# Altium schematic sheet Sheet1.SchDoc
size A4; SheetNumber: 1; SheetTotal: 1
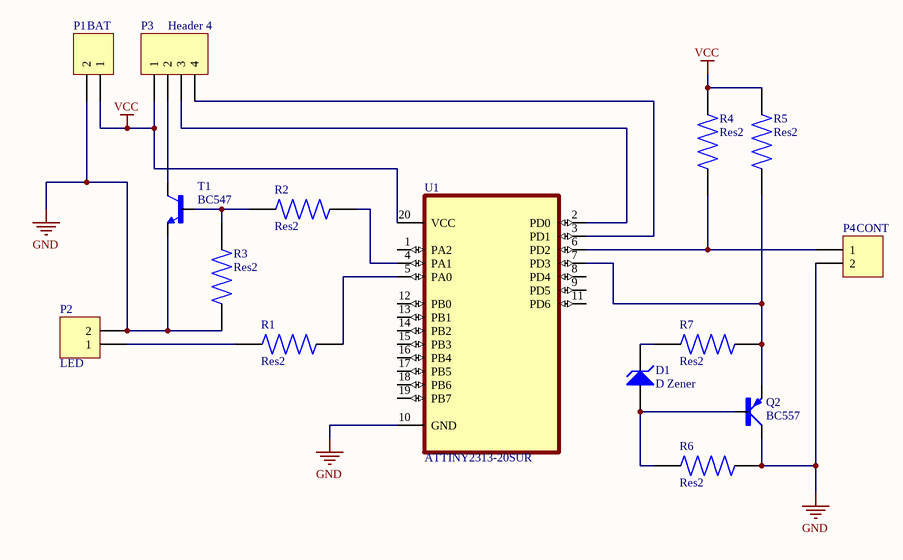
[diagram p0: Sheet1.SchDoc]

## Parts
D1  D Zener  [DIODE-0.7]
P1  BAT  [HDR1X2]
P2  LED  [HDR1X2]
P3  Header 4  [HDR1X4]
P4  CONT  [HDR1X2]
Q2  BC557  [SOT54A]
R1  Res2  [AXIAL-0.4]
R2  Res2  [AXIAL-0.4]
R3  Res2  [AXIAL-0.4]
R4  Res2  [AXIAL-0.4]
R5  Res2  [AXIAL-0.4]
R6  Res2  [AXIAL-0.4]
R7  Res2  [AXIAL-0.4]
T1  BC547  [TO92]
U1  ATTINY2313-20SUR  [SOIC127P1032X265-20N]

## Nets
GND: P1.2 P2.2 P4.2 Q2.C R3.1 R6.1 T1.1(E) U1.10(GND)
VCC: P1.1 P3.1 R4.2 R5.2 U1.20(VCC)
NetD1_1: D1.1(A) Q2.B R6.2
NetD1_2: D1.2(K) R7.1
NetP2_1: P2.1 R1.1
NetP3_2: P3.2 T1.3(C)
NetP3_3: P3.3 U1.2(PD0)
NetP3_4: P3.4 U1.3(PD1)
NetP4_1: P4.1 R4.1 U1.6(PD2)
NetQ2_E: Q2.E R5.1 R7.1 U1.7(PD3)
NetR1_2: R1.2 U1.5(PA0)
NetR2_1: R2.1 R3.2 T1.2(B)
NetR2_2: R2.2 U1.4(PA1)

Not connected (* = marked no-connect by the designer): U1 1(PA2) 8(PD4) 9(PD5) 11(PD6) 12(PB0) 13(PB1) 14(PB2) 15(PB3) 16(PB4) 17(PB5) 18(PB6) 19(PB7)

## Library data of the parts
D1 = D Zener: Zener Diode; Published: 8-Jun-2000; LatestRevisionDate: 17-Jul-2002; LatestRevisionNote: Re-released for DXP Platform.; PackageReference: DIODE-0.7; Publisher: Altium Limited; PackageDescription: Diode, Thru-Hole; 2 Leads; 0.7 in Pin Spacing
P1 P2 P4 = Header 2: Header, 2-Pin; LatestRevisionDate: 17-Jul-2002; LatestRevisionNote: Re-released for DXP Platform.; Publisher: Altium Limited
P3 = Header 4: Header, 4-Pin; LatestRevisionDate: 17-Jul-2002; LatestRevisionNote: Re-released for DXP Platform.; Publisher: Altium Limited
Q2 = BC557: Bipolar (BJT) Transistor PNP 45 V 100 mA 320MHz 625 mW Through Hole TO-92 (TO-226); MF: ON Semiconductor; SnapEDA_Link: https://www.snapeda.com/parts/BC557/Onsemi/view-part/?ref=snap; Package: E-PKG AXIAL-LEADED-2 ON Semiconductor; MP: BC557; Check_prices: https://www.snapeda.com/parts/BC557/Onsemi/view-part/?ref=eda; Purchase-URL: https://pricing.snapeda.com/search/part/BC557/?ref=eda; Price: None; Value: *; Availability: In Stock
R1-R7 = CRGCQ1206J10K: Fixed Resistor CRGCQ 1206 10K 5%; MF: TE Connectivity; DigiKey-Purchase-URL: https://snapeda.com/shop?store=DigiKey&id=3188341; Mouser-Purchase-URL: https://snapeda.com/shop?store=Mouser&id=3188341; Value: *; SnapEDA_Link: https://www.snapeda.com/parts/CRGCQ1206J10K/TE%20Connectivity/view-part/3188341/?ref=snap; Availability: Warning; Price: None; Package: 3115 TE Connectivity; MP: CRGCQ1206J10K
T1 = BC547: Trans GP BJT NPN 45V 0.1A 500mW 3-Pin TO-92 T/R; MF: ON Semiconductor; Package: None; MP: BC547; Check_prices: https://www.snapeda.com/parts/BC547/Onsemi/view-part/?ref=eda; Value: *; SnapEDA_Link: https://www.snapeda.com/parts/BC547/Onsemi/view-part/?ref=snap; Availability: In Stock; Price: None; Purchase-URL: https://pricing.snapeda.com/search/part/BC547/?ref=eda
U1 = ATTINY2313-20SUR: AVR series Microcontroller IC 8-Bit 20MHz 2KB (1K x 16) FLASH 20-SOIC; MF: Microchip Technology; Check_prices: https://www.snapeda.com/parts/ATTINY2313-20SUR/Microchip/view-part/?ref=eda; Value: *; Availability: In Stock; MP: ATTINY2313-20SUR; Price: None; Package: SOIC-20 Microchip Technology; SnapEDA_Link: https://www.snapeda.com/parts/ATTINY2313-20SUR/Microchip/view-part/?ref=snap; Purchase-URL: https://pricing.snapeda.com/search/part/ATTINY2313-20SUR/?ref=eda